# Altium schematic sheet SignalGen_DualChannel.SchDoc
size B; SheetNumber: 1; SheetTotal: 1
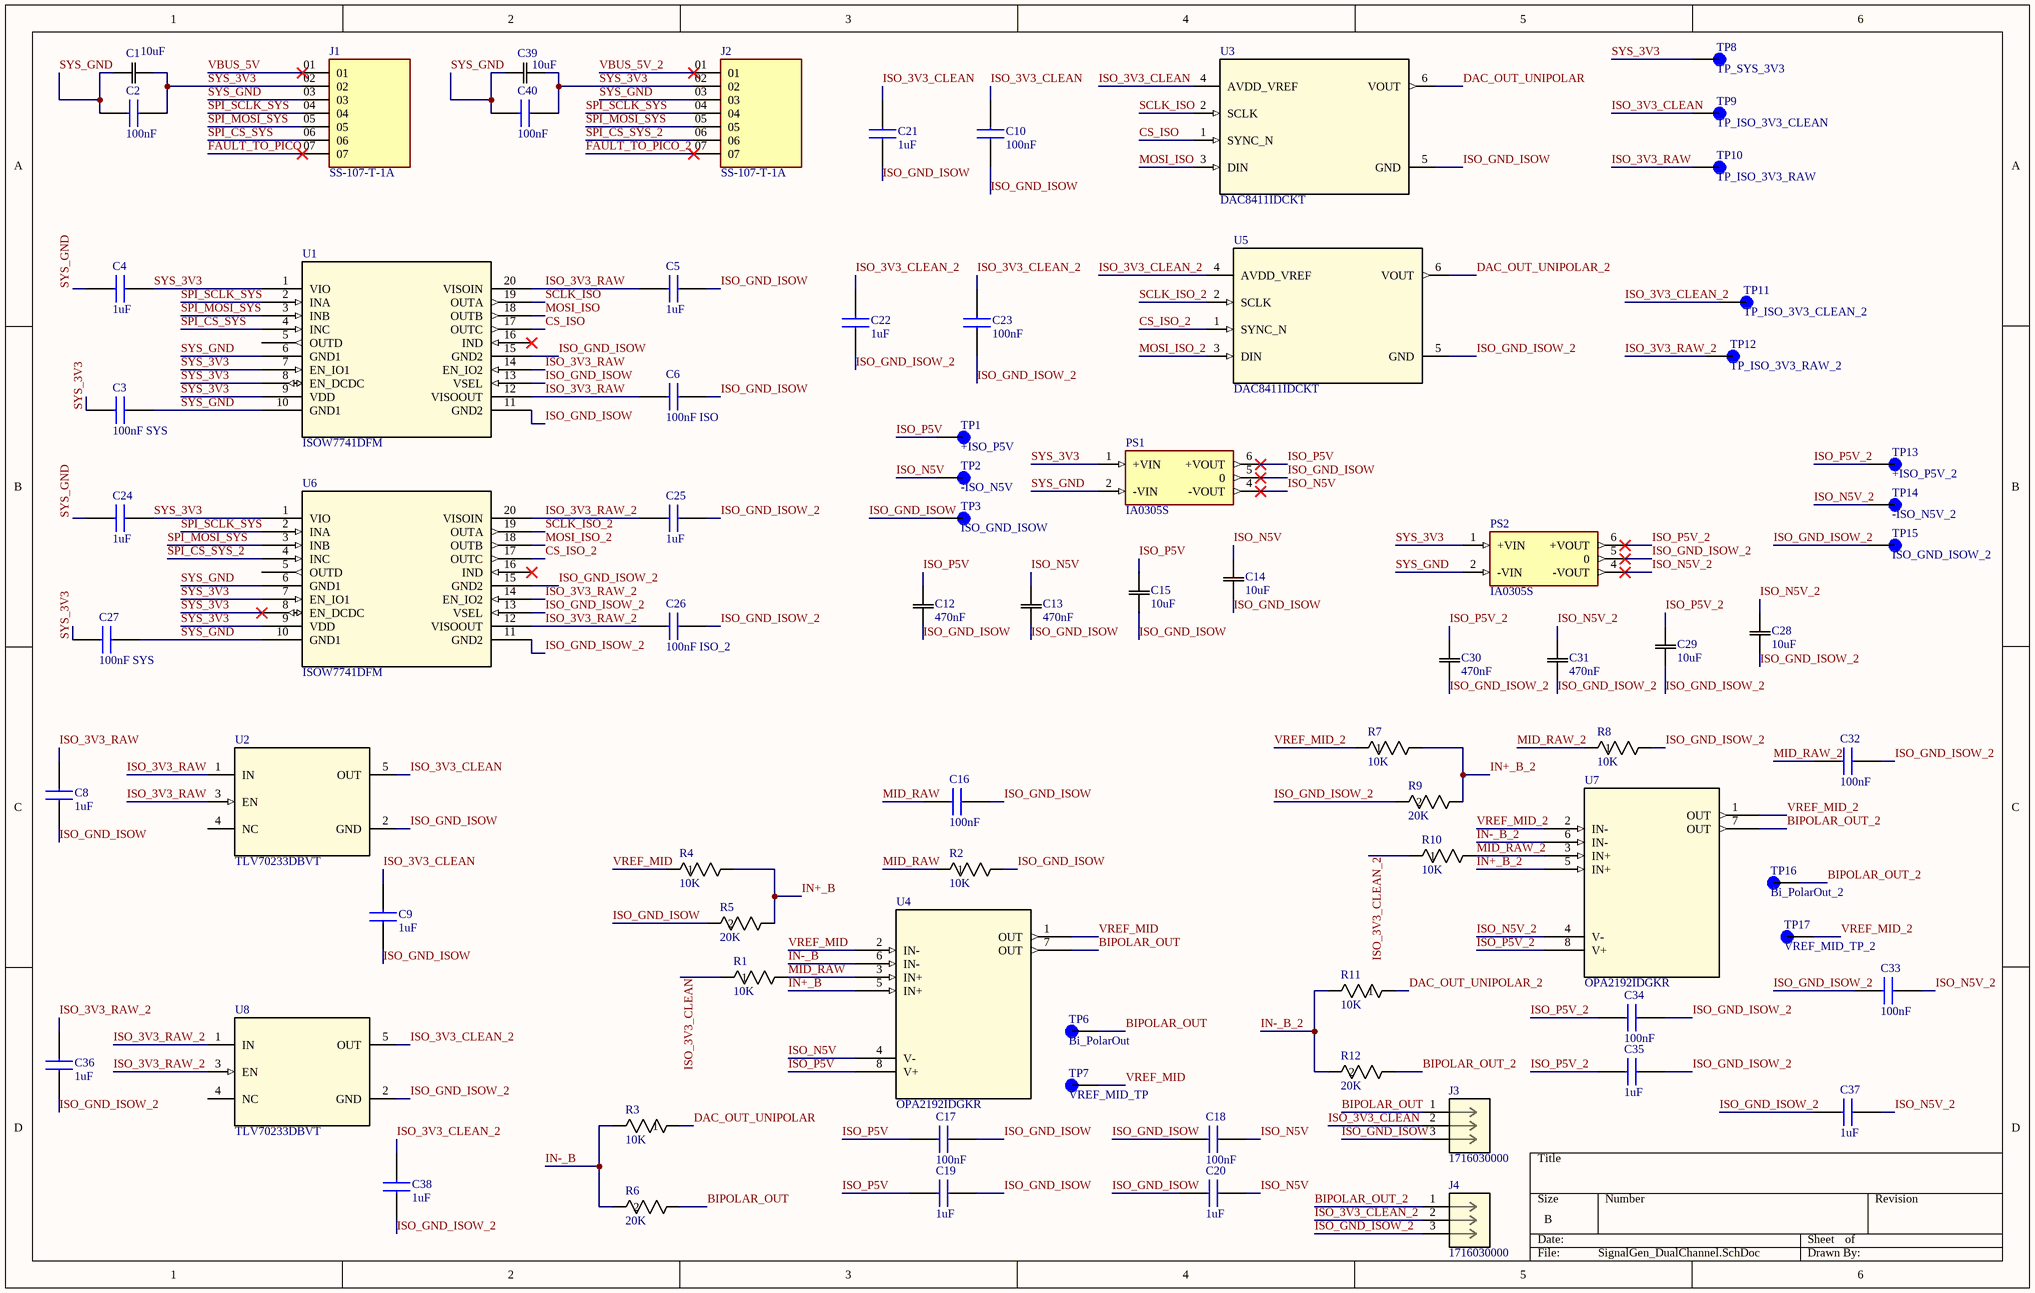
[diagram p0: SignalGen_DualChannel.SchDoc]

## Parts
C1  10uF  [G-21_MUR]
C2  100nF  [CAPC1608X90N]
C3  100nF SYS  [CAPC1608X90N]
C4  1uF  [INDC1608X90N]
C5  1uF  [INDC1608X90N]
C6  100nF ISO  [CAPC1608X90N]
C8  1uF  [INDC1608X90N]
C9  1uF  [INDC1608X90N]
C10  100nF  [CAPC1608X90N]
C12  470nF  [CAP_1608_TDK]
C13  470nF  [CAP_1608_TDK]
C14  10uF  [G-21_MUR]
C15  10uF  [G-21_MUR]
C16  100nF  [CAPC1608X90N]
C17  100nF  [CAPC1608X90N]
C18  100nF  [CAPC1608X90N]
C19  1uF  [INDC1608X90N]
C20  1uF  [INDC1608X90N]
C21  1uF  [INDC1608X90N]
C22  1uF  [INDC1608X90N]
C23  100nF  [CAPC1608X90N]
C24  1uF  [INDC1608X90N]
C25  1uF  [INDC1608X90N]
C26  100nF ISO_2  [CAPC1608X90N]
C27  100nF SYS  [CAPC1608X90N]
C28  10uF  [G-21_MUR]
C29  10uF  [G-21_MUR]
C30  470nF  [CAP_1608_TDK]
C31  470nF  [CAP_1608_TDK]
C32  100nF  [CAPC1608X90N]
C33  100nF  [CAPC1608X90N]
C34  100nF  [CAPC1608X90N]
C35  1uF  [INDC1608X90N]
C36  1uF  [INDC1608X90N]
C37  1uF  [INDC1608X90N]
C38  1uF  [INDC1608X90N]
C39  10uF  [G-21_MUR]
C40  100nF  [CAPC1608X90N]
J1  SS-107-T-1A  [SAMTEC_SS-107-T-1A]
J2  SS-107-T-1A  [SAMTEC_SS-107-T-1A]
J3  1716030000  [CONN_LM 5.080390_WED]
J4  1716030000  [CONN_LM 5.080390_WED]
PS1  IA0305S  [XP_IA0305S]
PS2  IA0305S  [XP_IA0305S]
R1  10K  [RC0603N_YAG]
R2  10K  [RC0603N_YAG]
R3  10K  [RC0603N_YAG]
R4  10K  [RC0603N_YAG]
R5  20K  [RC0603N_YAG]
R6  20K  [RC0603N_YAG]
R7  10K  [RC0603N_YAG]
R8  10K  [RC0603N_YAG]
R9  20K  [RC0603N_YAG]
R10  10K  [RC0603N_YAG]
R11  10K  [RC0603N_YAG]
R12  20K  [RC0603N_YAG]
TP1  +ISO_P5V  [KEYSTONE_5016]
TP2  -ISO_N5V  [KEYSTONE_5016]
TP3  ISO_GND_ISOW  [KEYSTONE_5016]
TP6  Bi_PolarOut  [KEYSTONE_5016]
TP7  VREF_MID_TP  [KEYSTONE_5016]
TP8  TP_SYS_3V3  [KEYSTONE_5016]
TP9  TP_ISO_3V3_CLEAN  [KEYSTONE_5016]
TP10  TP_ISO_3V3_RAW  [KEYSTONE_5016]
TP11  TP_ISO_3V3_CLEAN_2  [KEYSTONE_5016]
TP12  TP_ISO_3V3_RAW_2  [KEYSTONE_5016]
TP13  +ISO_P5V_2  [KEYSTONE_5016]
TP14  -ISO_N5V_2  [KEYSTONE_5016]
TP15  ISO_GND_ISOW_2  [KEYSTONE_5016]
TP16  Bi_PolarOut_2  [KEYSTONE_5016]
TP17  VREF_MID_TP_2  [KEYSTONE_5016]
U1  ISOW7741DFM  [SOIC20_DFM_TEX]
U2  TLV70233DBVT  [DBV0005A_N]
U3  DAC8411IDCKT  [DCK0006A_N]
U4  OPA2192IDGKR  [DGK0008A_N_TEX]
U5  DAC8411IDCKT  [DCK0006A_N]
U6  ISOW7741DFM  [SOIC20_DFM_TEX]
U7  OPA2192IDGKR  [DGK0008A_N_TEX]
U8  TLV70233DBVT  [DBV0005A_N]

## Nets
BIPOLAR_OUT: J3.1 R6.1 TP6.TP U4.7(OUT)
BIPOLAR_OUT_2: J4.1 R12.1 TP16.TP U7.7(OUT)
CS_ISO: U1.17(OUTC) U3.1(SYNC_N)
CS_ISO_2: U5.1(SYNC_N) U6.17(OUTC)
DAC_OUT_UNIPOLAR: R3.1 U3.6(VOUT)
DAC_OUT_UNIPOLAR_2: R11.1 U5.6(VOUT)
FAULT_TO_PICO: J1.07
FAULT_TO_PICO_2: J2.07
IN+_B: R4.2 R5.1 U4.5(IN+)
IN+_B_2: R7.2 R9.1 U7.5(IN+)
IN-_B: R3.2 R6.2 U4.6(IN-)
IN-_B_2: R11.2 R12.2 U7.6(IN-)
ISO_3V3_CLEAN: C9.2 C10.2 C21.2 J3.2 R1.1 TP9.TP U2.5(OUT) U3.4(AVDD_VREF)
ISO_3V3_CLEAN_2: C22.2 C23.2 C38.2 J4.2 R10.1 TP11.TP U5.4(AVDD_VREF) U8.5(OUT)
ISO_3V3_RAW: C5.1 C6.2 C8.2 TP10.TP U1.12(VISOOUT) U1.14(EN_IO2) U1.20(VISOIN) U2.1(IN) U2.3(EN)
ISO_3V3_RAW_2: C25.1 C26.2 C36.2 TP12.TP U6.12(VISOOUT) U6.14(EN_IO2) U6.20(VISOIN) U8.1(IN) U8.3(EN)
ISO_GND_ISOW: C5.2 C6.1 C8.1 C9.1 C10.1 C12.1 C13.1 C14.1 C15.1 C16.2 C17.2 C18.1 C19.2 C20.1 C21.1 J3.3 PS1.5(0) R2.2 R5.2 TP3.TP U1.11(GND2) U1.13(VSEL) U1.15(GND2) U2.2(GND) U3.5(GND)
ISO_GND_ISOW_2: C22.1 C23.1 C25.2 C26.1 C28.1 C29.1 C30.1 C31.1 C32.2 C33.1 C34.2 C35.2 C36.1 C37.1 C38.1 J4.3 PS2.5(0) R8.2 R9.2 TP15.TP U5.5(GND) U6.11(GND2) U6.13(VSEL) U6.15(GND2) U8.2(GND)
ISO_N5V: C13.2 C14.2 C18.2 C20.2 PS1.4(-VOUT) TP2.TP U4.4(V-)
ISO_N5V_2: C28.2 C31.2 C33.2 C37.2 PS2.4(-VOUT) TP14.TP U7.4(V-)
ISO_P5V: C12.2 C15.2 C17.1 C19.1 PS1.6(+VOUT) TP1.TP U4.8(V+)
ISO_P5V_2: C29.2 C30.2 C34.1 C35.1 PS2.6(+VOUT) TP13.TP U7.8(V+)
MID_RAW: C16.1 R1.2 R2.1 U4.3(IN+)
MID_RAW_2: C32.1 R8.1 R10.2 U7.3(IN+)
MOSI_ISO: U1.18(OUTB) U3.3(DIN)
MOSI_ISO_2: U5.3(DIN) U6.18(OUTB)
SCLK_ISO: U1.19(OUTA) U3.2(SCLK)
SCLK_ISO_2: U5.2(SCLK) U6.19(OUTA)
SPI_CS_SYS: J1.06 U1.4(INC)
SPI_CS_SYS_2: J2.06 U6.4(INC)
SPI_MOSI_SYS: J1.05 J2.05 U1.3(INB) U6.3(INB)
SPI_SCLK_SYS: J1.04 J2.04 U1.2(INA) U6.2(INA)
SYS_3V3: C1.1 C2.1 C3.2 C4.2 C24.2 C27.2 C39.1 C40.1 J1.02 J2.02 PS1.1(+VIN) PS2.1(+VIN) TP8.TP U1.1(VIO) U1.7(EN_IO1) U1.8(EN_DCDC) U1.9(VDD) U6.1(VIO) U6.7(EN_IO1) U6.8(EN_DCDC) U6.9(VDD)
SYS_GND: C1.2 C2.2 C3.1 C4.1 C24.1 C27.1 C39.2 C40.2 J1.03 J2.03 PS1.2(-VIN) PS2.2(-VIN) U1.6(GND1) U1.10(GND1) U6.6(GND1) U6.10(GND1)
VBUS_5V: J1.01
VBUS_5V_2: J2.01
VREF_MID: R4.1 TP7.TP U4.1(OUT) U4.2(IN-)
VREF_MID_2: R7.1 TP17.TP U7.1(OUT) U7.2(IN-)

Not connected (* = marked no-connect by the designer): U1 5(OUTD) 16(IND)*; U2 4(NC); U6 5(OUTD) 16(IND)*; U8 4(NC)

## Library data of the parts
C1 C14 C15 C28 C29 C39 = GRM21BR61E106KA73L: Description; Manufacturer_Name: Murata; Copyright: Copyright (C) 2025 Ultra Librarian. All rights reserved.; Manufacturer_Part_Number: GRM21BR61E106KA73L
C2 C3 C6 C10 C16-C18 C23 C26 C27 C32-C34 C40 = CC0603KRX7R8BB104: Cap Ceramic 0.1uF 25V X7R 10% Pad SMD 0603 125C T/R; Manufacturer_Name: YAGEO; Geometry.Height: 0.9mm; Mouser Part Number: 603-CC603KRX7R8BB104; Mouser Price/Stock: https://www.mouser.co.uk/ProductDetail/YAGEO/CC0603KRX7R8BB104?qs=AgBp2OyFlx%252B4QOgEm%2Fb3YQ%3D%3D; Manufacturer_Part_Number: CC0603KRX7R8BB104; Datasheet Link: https://www.arrow.com/en/products/cc0603krx7r8bb104/yageo?region=nac
C4 C5 C8 C9 C19-C22 C24 C25 C35-C38 = MBASE168SB7105KTNA18: Taiyo Yuden CAP, MLCC, 0603, 16V, X7R, 1 uF 10 %, T&R; Geometry.Height: 0.9mm; Mouser Part Number: *; Mouser Price/Stock: *; Manufacturer_Name: TAIYO YUDEN; Manufacturer_Part_Number: MBASE168SB7105KTNA18; Datasheet Link: https://ds.yuden.co.jp/TYCOMPAS/ut/specSheet?pn=MBASE168SB7105KTNA18
C12 C13 C30 C31 = C1608X7R1H474K080AC: CAPACITOR; SMT (0603); CERAMIC CHIP; 0.47UF; 50V; TOL=10%; TG=-55 DEGC TO +125 DEGC; TC=X7R; AUTO; Manufacturer_Name: TDK; Copyright: Copyright (C) 2026 Ultra Librarian. All rights reserved.; Manufacturer_Part_Number: C1608X7R1H474K080AC
J3 J4 = 1716030000: Description; Manufacturer_Name: Weidmuller; Copyright: Copyright (C) 2025 Ultra Librarian. All rights reserved.; Manufacturer_Part_Number: 1716030000; RefDes: RefDes; Type: Type
PS1 PS2 = IA0305S: DC DC CONVERTER +/-5V 1W; Package: None; Price: None; Value: *; MP: IA0305S; Availability: Unavailable
R1-R4 R7 R8 R10 R11 = RC0603FR-0710KL: RES SMD 10kO 1% 1/10W 0603; Manufacturer_Name: Yageo; Copyright: Copyright (C) 2025 Ultra Librarian. All rights reserved.; Manufacturer_Part_Number: RC0603FR-0710KL
R5 R6 R9 R12 = RC0603FR-0720KL: Description; Manufacturer_Name: Yageo; Copyright: Copyright (C) 2025 Ultra Librarian. All rights reserved.; Manufacturer_Part_Number: RC0603FR-0720KL
TP1-TP3 TP6-TP17 = 5016: Test Point Compact SMT Phos Bronze/Silver 1000pc Tape & Reel | Keystone Electronics 5016; SnapEDA_Link: https://www.snapeda.com/parts/5016/Keystone/view-part/?ref=snap; Package: NON STANDARD-1 Keystone; Value: *; MF: Keystone Electronics; MP: 5016; Check_prices: https://www.snapeda.com/parts/5016/Keystone/view-part/?ref=eda
U1 U6 = ISOW7741DFM: Low-emissions, low-ripple, quad-channel, 3/1, reinforced digital isolator with integrated power 20-SOIC -40 to 125; Manufacturer_Name: Texas Instruments; Copyright: Copyright (C) 2026 Ultra Librarian. All rights reserved.; Manufacturer_Part_Number: ISOW7741DFM; RefDes: RefDes; Type: Type
U2 U8 = TLV70233DBVT: 300-mA, high-PSRR, low-IQ, low-dropout voltage regulator with enable 5-SOT-23 -40 to 125; Manufacturer_Name: Texas Instruments; PartNumber: TLV70212DBVR; Alternate_PartNumber: TLV70212DBVT; CompType: IC; TYPE: TYPE; RefDes: RefDes; Copyright: Copyright (C) 2026 Ultra Librarian. All rights reserved.; Manufacturer_Part_Number: TLV70233DBVT; Application_BuildNumber: *; PackageReference: DBV0005A; MountType: SMT; RoHS: Y; Manufacturer: Texas Instruments
U3 U5 = DAC8411IDCKT: 16bit, Single Channel, 80uA, 2.0V-5.5V DAC in SC70 Package 6-SC70 -40 to 125; Manufacturer_Name: Texas Instruments; PartNumber: DAC8411IDCKR; CompType: IC; TYPE: TYPE; RefDes: RefDes; Copyright: Copyright (C) 2025 Ultra Librarian. All rights reserved.; Manufacturer_Part_Number: DAC8411IDCKT; Application_BuildNumber: *; Alternate_PartNumber: DAC8411IDCKT; PackageReference: DCK0006A; MountType: SMT; RoHS: Y; Manufacturer: Texas Instruments
U4 U7 = OPA2192IDGKR: 36-V, Precision, RRIO, Low Offset Voltage, Low Input Bias Current Op Amp With e-trim 8-VSSOP -40 to 125; Manufacturer_Name: Texas Instruments; Copyright: Copyright (C) 2025 Ultra Librarian. All rights reserved.; Manufacturer_Part_Number: OPA2192IDGKR; RefDes: RefDes; Type: Type
J1 J2 = SS-107-T-1A: Package: None; Price: None; Value: *; MP: SS-107-T-1A; Availability: Unavailable